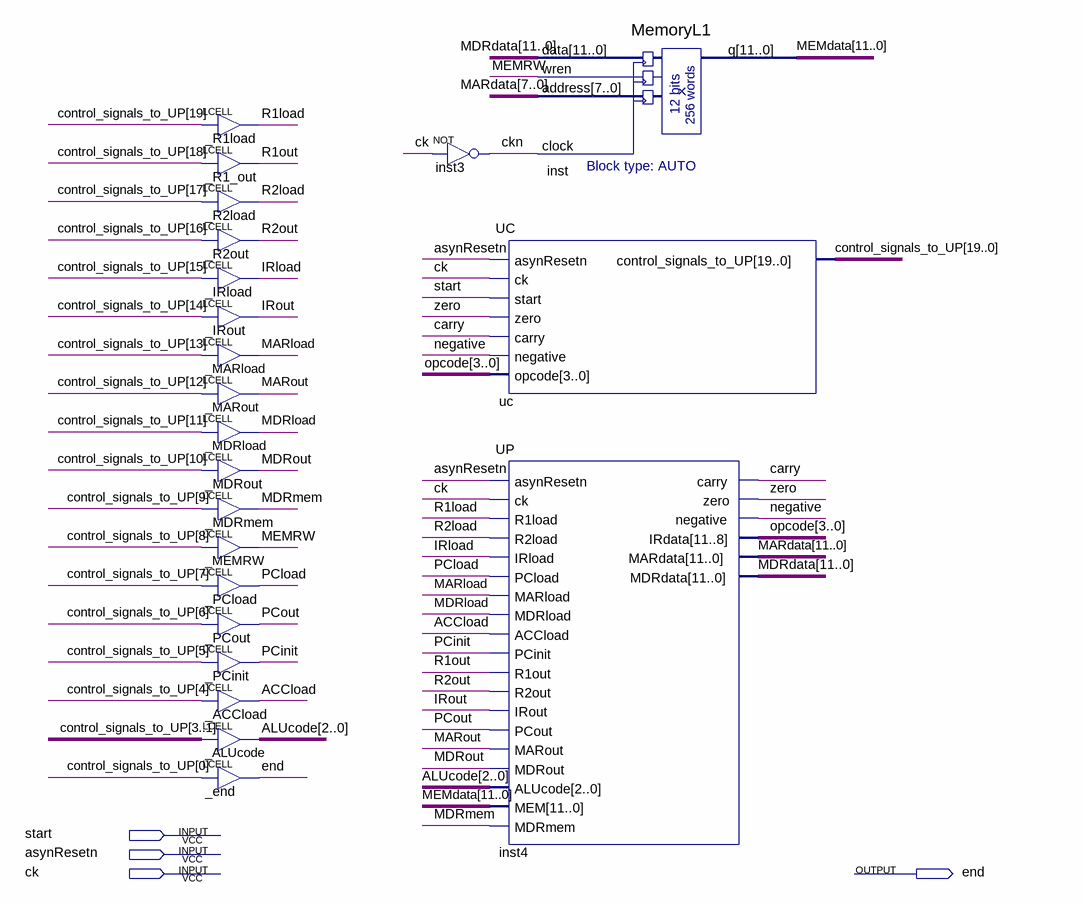
[diagram p0: schematic sheet]
// Quartus schematic littleProc.bdf as structural Verilog: 22 symbols, 4 pins
module littleProc (
  input  start,
  input  asynResetn,
  input  ck,
  output \end 
);

  wire ACCload, carry, ckn, IRload, IRout, MARload, MARout, MDRload, MDRmem, MDRout, MEMRW, negative, PCinit,
       PCload, PCout, R1load, R1out, R2load, R2out, zero;
  wire [2:0] ALUcode;
  wire [3:0] opcode;
  wire [11:0] MARdata, MDRdata, MEMdata;
  wire [19:0] control_signals_to_UP;

  LCELL _R1load (.IN(control_signals_to_UP[19]), .OUT(R1load));
  LCELL _R1_out (.IN(control_signals_to_UP[18]), .OUT(R1out));
  LCELL _R2load (.IN(control_signals_to_UP[17]), .OUT(R2load));
  LCELL _R2out (.IN(control_signals_to_UP[16]), .OUT(R2out));
  LCELL _IRload (.IN(control_signals_to_UP[15]), .OUT(IRload));
  LCELL _IRout (.IN(control_signals_to_UP[14]), .OUT(IRout));
  LCELL _MARload (.IN(control_signals_to_UP[13]), .OUT(MARload));
  LCELL _MARout (.IN(control_signals_to_UP[12]), .OUT(MARout));
  LCELL _MDRload (.IN(control_signals_to_UP[11]), .OUT(MDRload));
  LCELL _MDRout (.IN(control_signals_to_UP[10]), .OUT(MDRout));
  LCELL _MDRmem (.IN(control_signals_to_UP[9]), .OUT(MDRmem));
  LCELL _MEMRW (.IN(control_signals_to_UP[8]), .OUT(MEMRW));
  LCELL _PCload (.IN(control_signals_to_UP[7]), .OUT(PCload));
  LCELL _PCout (.IN(control_signals_to_UP[6]), .OUT(PCout));
  LCELL _PCinit (.IN(control_signals_to_UP[5]), .OUT(PCinit));
  LCELL _ACCload (.IN(control_signals_to_UP[4]), .OUT(ACCload));
  LCELL _ALUcode[2:0] (.IN(control_signals_to_UP[3:1]), .OUT(ALUcode));
  LCELL _end (.IN(control_signals_to_UP[0]), .OUT(\end ));
  not inst3 (ckn, ck);
  UC uc (
    .asynResetn(asynResetn), .ck(ck), .start(start), .zero(zero), .carry(carry), .negative(negative),
    .opcode(opcode), .control_signals_to_UP(control_signals_to_UP));
  UP inst4 (
    .asynResetn(asynResetn), .ck(ck), .R1load(R1load), .R2load(R2load), .IRload(IRload), .PCload(PCload),
    .MARload(MARload), .MDRload(MDRload), .ACCload(ACCload), .PCinit(PCinit), .R1out(R1out), .R2out(R2out),
    .IRout(IRout), .PCout(PCout), .MARout(MARout), .MDRout(MDRout), .ALUcode(ALUcode), .MEM(MEMdata),
    .MDRmem(MDRmem), .carry(carry), .zero(zero), .negative(negative), .IRdata(opcode), .MARdata(MARdata),
    .MDRdata(MDRdata));
  MemoryL1 inst (.data(MDRdata), .wren(MEMRW), .address(MARdata[7:0]), .clock(ckn), .q(MEMdata));
endmodule
